# Altium project InkJetFin.PrjPCB
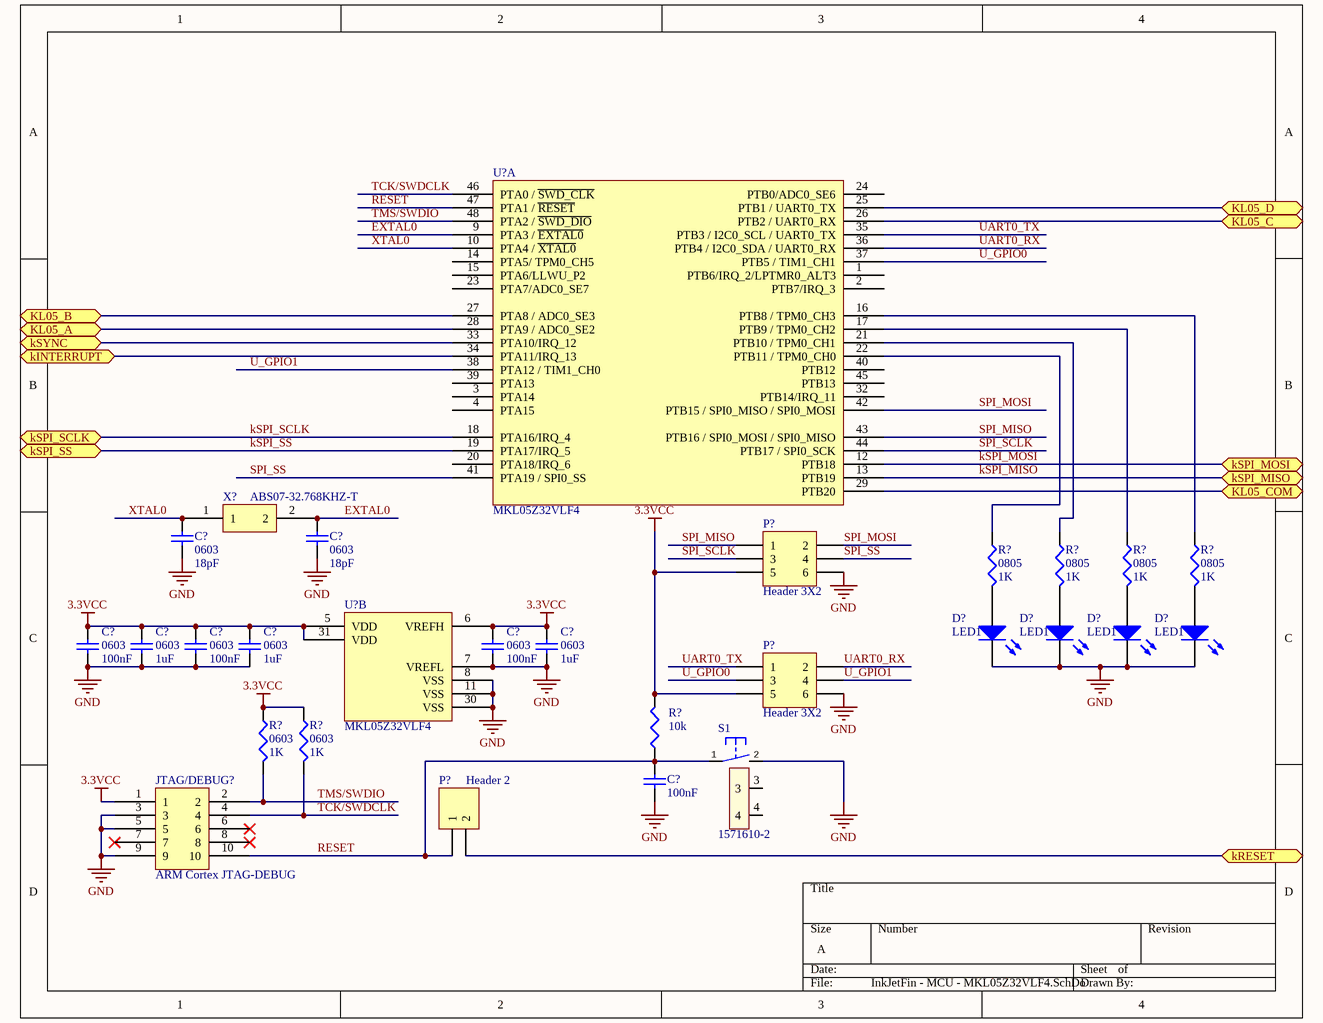
[diagram p0: InkJetFin - MCU - MKL05Z32VLF4.SchDoc]
5 sheets, 41 parts. Net scope: flat (ports and power ports of the same name join across sheets).
Sheets:
  InkJetFin - MCU - MKL05Z32VLF4.SchDoc
  InkJetFin - Power.SchDoc
  InkJetFin - InkJet Cartridge Interface.SchDoc
  InkJetFin - Kinen Port.SchDoc
  InkJetFin - System.SchDoc

## Sheet InkJetFin - MCU - MKL05Z32VLF4.SchDoc
size A

### Parts
(Parts that share a designator on the sheet are numbered #1, #2 ... from top to bottom, then left to right.)
C?#1  0603  value 18pF  [1608[0603]]
C?#2  0603  value 18pF  [1608[0603]]
C?#3  0603  value 100nF  [1608[0603]]
C?#4  0603  value 1uF  [1608[0603]]
C?#5  0603  value 100nF  [1608[0603]]
C?#6  0603  value 1uF  [1608[0603]]
C?#7  0603  value 100nF  [1608[0603]]
C?#8  0603  value 1uF  [1608[0603]]
C?#9  value 100nF  [1608[0603]]  (hidden comment: Cap Semi)
D?#1  LED1  [SM 0805 polarized]
D?#2  LED1  [SM 0805 polarized]
D?#3  LED1  [SM 0805 polarized]
D?#4  LED1  [SM 0805 polarized]
JTAG/DEBUG?  ARM Cortex JTAG-DEBUG  [FTSH-105-XX-X-DV]
P?#1  Header 3X2  [HDR2X3]
P?#2  Header 3X2  [HDR2X3]
P?#3  Header 2  [HDR1X2]
R?#1  0805  value 1K  [SM 0805 - gap trimmed]
R?#2  0805  value 1K  [SM 0805 - gap trimmed]
R?#3  0805  value 1K  [SM 0805 - gap trimmed]
R?#4  0805  value 1K  [SM 0805 - gap trimmed]
R?#5  0603  value 1K  [J1-0603]
R?#6  0603  value 1K  [J1-0603]
R?#7  value 10k  [J1-0603]  (hidden comment: Res3)
S1  1571610-2  [B3F-31XX]
U?#1  MKL05Z32VLF4  [MKL05Z32VLF4]  (part A of 2)
U?#2  MKL05Z32VLF4  [MKL05Z32VLF4]  (part B of 2)
X?  ABS07-32.768KHZ-T  [ABS07-32.768KHZ-T]

### Ports
kINTERRUPT, KL05_A, KL05_B, KL05_C, KL05_COM, KL05_D, kRESET, kSPI_MISO, kSPI_MOSI, kSPI_SCLK, kSPI_SS, kSYNC

### Nets
3.3VCC: C?#3.1 C?#4.1 C?#5.2 C?#6.2 C?#7.2 C?#8.2 JTAG/DEBUG?.1 P?#1.5 P?#2.5 R?#5.1 R?#6.1 R?#7.2 U?#2.5(VDD) U?#2.6(VREFH) U?#2.31(VDD)
GND: C?#1.2 C?#2.2 C?#3.2 C?#4.2 C?#5.1 C?#6.1 C?#7.1 C?#8.1 C?#9.1 D?#1.1(A) D?#2.1(A) D?#3.1(A) D?#4.1(A) JTAG/DEBUG?.3 JTAG/DEBUG?.5 JTAG/DEBUG?.9 P?#1.6 P?#2.6 S1.2(S) U?#2.7(VREFL) U?#2.8(VSS) U?#2.11(VSS) U?#2.30(VSS)
EXTAL0: C?#2.1 U?#1.9(PTA3_/_~{EXTAL0}) X?.2
kSPI_MISO: U?#1.13(PTB19) ; port kSPI_MISO
kSPI_MOSI: U?#1.12(PTB18) ; port kSPI_MOSI
kSPI_SCLK: U?#1.18(PTA16/IRQ_4) ; port kSPI_SCLK
kSPI_SS: U?#1.19(PTA17/IRQ_5) ; port kSPI_SS
RESET: C?#9.2 JTAG/DEBUG?.10 P?#3.1 R?#7.1 S1.1(P) U?#1.47(PTA1_/_~{RESET})
SPI_MISO: P?#1.1 U?#1.43(PTB16_/_SPI0_MOSI_/_SPI0_MISO)
SPI_MOSI: P?#1.2 U?#1.42(PTB15_/_SPI0_MISO_/_SPI0_MOSI)
SPI_SCLK: P?#1.3 U?#1.44(PTB17_/_SPI0_SCK)
SPI_SS: P?#1.4 U?#1.41(PTA19_/_SPI0_SS)
TCK/SWDCLK: JTAG/DEBUG?.4 R?#6.2 U?#1.46(PTA0_/_~{SWD_CLK})
TMS/SWDIO: JTAG/DEBUG?.2 R?#5.2 U?#1.48(PTA2_/_~{SWD_DIO})
U_GPIO0: P?#2.3 U?#1.37(PTB5_/_TIM1_CH1)
U_GPIO1: P?#2.4 U?#1.38(PTA12_/_TIM1_CH0)
UART0_RX: P?#2.2 U?#1.36(PTB4_/_I2C0_SDA_/_UART0_RX)
UART0_TX: P?#2.1 U?#1.35(PTB3_/_I2C0_SCL_/_UART0_TX)
XTAL0: C?#1.1 U?#1.10(PTA4_/_~{XTAL0}) X?.1
NetD?#1_2: D?#1.2(K) R?#1.2
NetD?#2_2: D?#2.2(K) R?#2.2
NetD?#3_2: D?#3.2(K) R?#3.2
NetD?#4_2: D?#4.2(K) R?#4.2
NetK?_11: P?#3.2 ; port kRESET
NetK?_13: U?#1.33(PTA10/IRQ_12) ; port kSYNC
NetK?_14: U?#1.34(PTA11/IRQ_13) ; port kINTERRUPT
NetR?#1_1: R?#1.1 U?#1.22(PTB11_/_TPM0_CH0)
NetR?#2_1: R?#2.1 U?#1.21(PTB10_/_TPM0_CH1)
NetR?#3_1: R?#3.1 U?#1.17(PTB9_/_TPM0_CH2)
NetR?#4_1: R?#4.1 U?#1.16(PTB8_/_TPM0_CH3)
NetU?#1_25: U?#1.25(PTB1_/_UART0_TX) ; port KL05_D
NetU?#1_26: U?#1.26(PTB2_/_UART0_RX) ; port KL05_C
NetU?#1_27: U?#1.27(PTA8_/_ADC0_SE3) ; port KL05_B
NetU?#1_28: U?#1.28(PTA9_/_ADC0_SE2) ; port KL05_A
NetU?#1_29: U?#1.29(PTB20) ; port KL05_COM

Not connected (* = marked no-connect by the designer): JTAG/DEBUG? 6* 7* 8*; S1 3 4; U?#1 1(PTB6/IRQ_2/LPTMR0_ALT3) 2(PTB7/IRQ_3) 3(PTA14) 4(PTA15) 14(PTA5/_TPM0_CH5) 15(PTA6/LLWU_P2) 20(PTA18/IRQ_6) 23(PTA7/ADC0_SE7) 24(PTB0/ADC0_SE6) 32(PTB14/IRQ_11) 39(PTA13) 40(PTB12) 45(PTB13)

### Library data of the parts
C?#1-C?#9 = Cap Semi: Capacitor (Semiconductor SIM Model); Published: 8-Jun-2000; LatestRevisionDate: 29-May-2009; LatestRevisionNote: IPC-7351 Footprint Added.; PackageReference: C1206; Publisher: Altium Limited; PackageDescription: Chip Capacitor
D?#1-D?#4 = LED1: Typical RED GaAs LED; Published: 8-Jun-2000; LatestRevisionDate: 08-Jul-2005; LatestRevisionNote: Mech Layer 1 removed.; PackageReference: LED-1; Publisher: Altium Limited; PackageDescription: LED; 2 Leads
JTAG/DEBUG? = ARM Cortex JTAG-DEBUG Header
P?#1 P?#2 = Header 3X2: Header, 3-Pin, Dual row; LatestRevisionDate: 17-Jul-2002; LatestRevisionNote: Re-released for DXP Platform.; Publisher: Altium Limited
P?#3 = Header 2: Header, 2-Pin; LatestRevisionDate: 17-Jul-2002; LatestRevisionNote: Re-released for DXP Platform.; Publisher: Altium Limited
R?#1-R?#7 = Res3: Resistor; Published: 8-Jun-2000; LatestRevisionDate: 29-May-2009; LatestRevisionNote: IPC-7351 Footprint Added.; PackageReference: J1-0603; Publisher: Altium Limited; PackageDescription: Chip Resistor
S1 = 1571610-2_1: SWTCH Momentary Washable; Manufacturer: Omron; Manufacturer: TE; LastRevisionNote: Import; ComponentLink1URL: http://www.te.com/commerce/DocumentDelivery/DDEController?Action=srchrtrv&DocNm=1571610&DocType=Customer+Drawing&DocLang=English; ComponentLink1Description: Datasheet for B3F-31XX; Published: 23-Apr-2014; Publisher: UltiMachine; LastRevisionDate: 23-Apr-2014; ManufacturerPartNumber: 1571610-2; Supplier 1: Mouser; Supplier Part Number 1: 506-1571610-2
U?#1 U?#2 = MKL05Z32VLF4: ARM Cortex M0+
X? = ABS07-32.768KHZ-T: ABS07-32.768KHZ-T RTC Crystal Oscillator

## Sheet InkJetFin - Power.SchDoc
size A

## Sheet InkJetFin - InkJet Cartridge Interface.SchDoc
size A
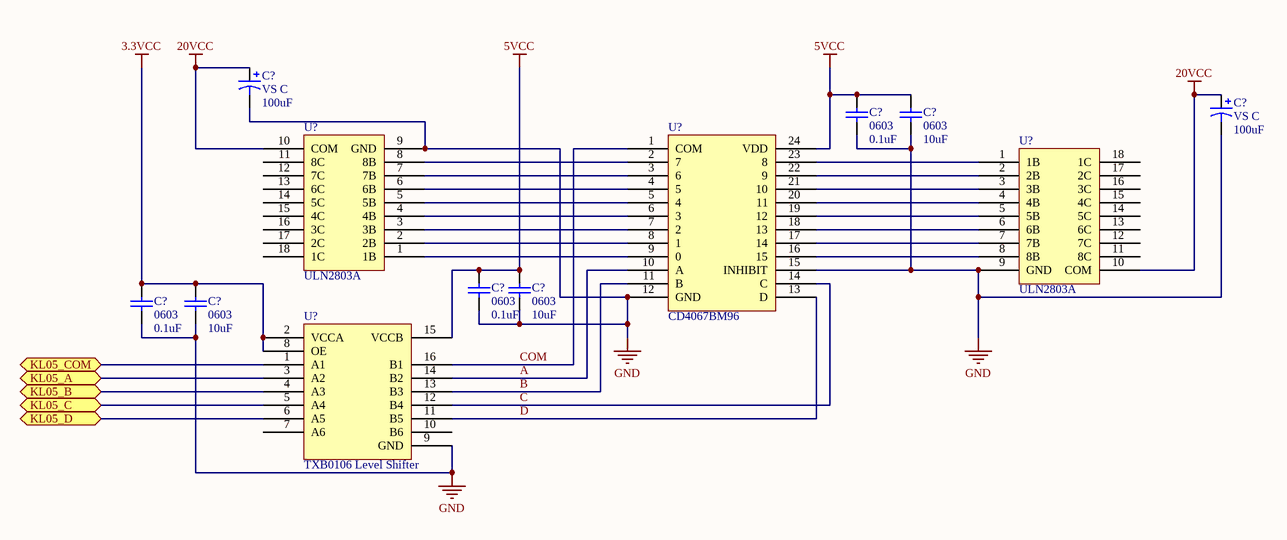
[diagram p1: InkJetFin - InkJet Cartridge Interface.SchDoc]

### Parts
(Parts that share a designator on the sheet are numbered #1, #2 ... from top to bottom, then left to right.)
C?#10  VS C  value 100uF  [Panasonic VS C]
C?#11  VS C  value 100uF  [Panasonic VS C]
C?#12  0603  value 0.1uF  [1608[0603]]
C?#13  0603  value 10uF  [1608[0603]]
C?#14  0603  value 0.1uF  [1608[0603]]
C?#15  0603  value 10uF  [1608[0603]]
C?#16  0603  value 0.1uF  [1608[0603]]
C?#17  0603  value 10uF  [1608[0603]]
U?#3  ULN2803A  [SOIC127P1030X265-18N]
U?#4  CD4067BM96  [TSOP65P640X120-24N]
U?#5  ULN2803A  [SOIC127P1030X265-18N]
U?#6  TXB0106 Level Shifter  [TSOP65P640X120-16N]

### Ports
KL05_A, KL05_B, KL05_C, KL05_COM, KL05_D

### Nets
3.3VCC: C?#16.2 C?#17.2 U?#6.2(VCCA) U?#6.8(OE)
5VCC: C?#12.2 C?#13.2 C?#14.2 C?#15.2 U?#4.24(VDD) U?#6.15(VCCB)
20VCC: C?#10.1 C?#11.1 U?#3.10(COM) U?#5.10(COM)
GND: C?#10.2 C?#11.2 C?#12.1 C?#13.1 C?#14.1 C?#15.1 C?#16.1 C?#17.1 U?#3.9(GND) U?#4.12(GND) U?#4.15(INHIBIT) U?#5.9(GND) U?#6.9(GND)
A: U?#4.10(A) U?#6.14(B2)
B: U?#4.11(B) U?#6.13(B3)
C: U?#4.14(C) U?#6.12(B4)
COM: U?#4.1(COM) U?#6.16(B1)
D: U?#4.13(D) U?#6.11(B5)
NetU?#1_25: U?#6.6(A5) ; port KL05_D
NetU?#1_26: U?#6.5(A4) ; port KL05_C
NetU?#1_27: U?#6.4(A3) ; port KL05_B
NetU?#1_28: U?#6.3(A2) ; port KL05_A
NetU?#1_29: U?#6.1(A1) ; port KL05_COM
NetU?#3_1: U?#3.1(1B) U?#4.9(0)
NetU?#3_2: U?#3.2(2B) U?#4.8(1)
NetU?#3_3: U?#3.3(3B) U?#4.7(2)
NetU?#3_4: U?#3.4(4B) U?#4.6(3)
NetU?#3_5: U?#3.5(5B) U?#4.5(4)
NetU?#3_6: U?#3.6(6B) U?#4.4(5)
NetU?#3_7: U?#3.7(7B) U?#4.3(6)
NetU?#3_8: U?#3.8(8B) U?#4.2(7)
NetU?#4_16: U?#4.16(15) U?#5.8(8B)
NetU?#4_17: U?#4.17(14) U?#5.7(7B)
NetU?#4_18: U?#4.18(13) U?#5.6(6B)
NetU?#4_19: U?#4.19(12) U?#5.5(5B)
NetU?#4_20: U?#4.20(11) U?#5.4(4B)
NetU?#4_21: U?#4.21(10) U?#5.3(3B)
NetU?#4_22: U?#4.22(9) U?#5.2(2B)
NetU?#4_23: U?#4.23(8) U?#5.1(1B)

Not connected (* = marked no-connect by the designer): U?#3 11(8C) 12(7C) 13(6C) 14(5C) 15(4C) 16(3C) 17(2C) 18(1C); U?#5 11(8C) 12(7C) 13(6C) 14(5C) 15(4C) 16(3C) 17(2C) 18(1C); U?#6 7(A6) 10(B6)

### Library data of the parts
C?#10 C?#11 = Cap Pol1: Polarized Capacitor (Radial); Published: 8-Jun-2000; LatestRevisionDate: 17-Jul-2002; LatestRevisionNote: Re-released for DXP Platform.; PackageReference: RB7.6-15; Publisher: Altium Limited; PackageDescription: Polarized Capacitor (Radial); 2 Leads
C?#12-C?#17 = Cap Semi: Capacitor (Semiconductor SIM Model); Published: 8-Jun-2000; LatestRevisionDate: 29-May-2009; LatestRevisionNote: IPC-7351 Footprint Added.; PackageReference: C1206; Publisher: Altium Limited; PackageDescription: Chip Capacitor
U?#3 U?#5 = Ti ULN2803A
U?#4 = Ti CD4067BM96
U?#6 = TXB0106: TXB0106 - Bidriectional Opendrain/pushpull level shift

## Sheet InkJetFin - Kinen Port.SchDoc
size A
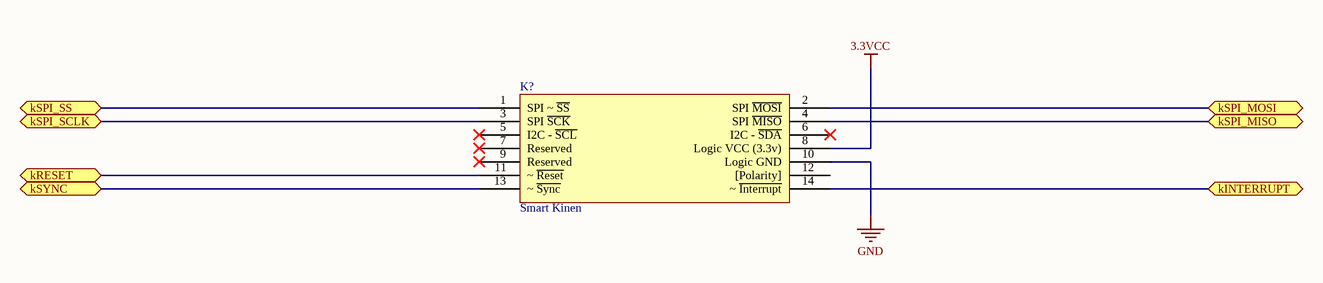
[diagram p2: InkJetFin - Kinen Port.SchDoc]

### Parts
K?  Smart Kinen  [Kinen Port - Device]

### Ports
kINTERRUPT, kRESET, kSPI_MISO, kSPI_MOSI, kSPI_SCLK, kSPI_SS, kSYNC

### Nets
3.3VCC: K?.8(Logic_VCC_(3.3v))
GND: K?.10(Logic_GND)
kSPI_MISO: K?.4(SPI_~{MISO}) ; port kSPI_MISO
kSPI_MOSI: K?.2(SPI_~{MOSI}) ; port kSPI_MOSI
kSPI_SCLK: K?.3(SPI_~{SCK}) ; port kSPI_SCLK
kSPI_SS: K?.1(SPI_~_~{SS}) ; port kSPI_SS
NetK?_11: K?.11(~_~{Reset}) ; port kRESET
NetK?_13: K?.13(~_~{Sync}) ; port kSYNC
NetK?_14: K?.14(~_~{Interrupt}) ; port kINTERRUPT

Not connected (* = marked no-connect by the designer): K? 5(I2C_-_~{SCL})* 6(I2C_-_~{SDA})* 7(Reserved)* 9(Reserved)* 12([Polarity])

### Library data of the parts
K? = Kinen Device NEW Smart

## Sheet InkJetFin - System.SchDoc
size A

## Nets that join several sheets
3.3VCC: InkJetFin - MCU - MKL05Z32VLF4 (15 pins), InkJetFin - InkJet Cartridge Interface (C?#16.2 C?#17.2 U?#6.2 U?#6.8), InkJetFin - Kinen Port (K?.8)
GND: InkJetFin - MCU - MKL05Z32VLF4 (23 pins), InkJetFin - InkJet Cartridge Interface (13 pins), InkJetFin - Kinen Port (K?.10)
kSPI_MISO: InkJetFin - MCU - MKL05Z32VLF4 (U?#1.13), InkJetFin - Kinen Port (K?.4)
kSPI_MOSI: InkJetFin - MCU - MKL05Z32VLF4 (U?#1.12), InkJetFin - Kinen Port (K?.2)
kSPI_SCLK: InkJetFin - MCU - MKL05Z32VLF4 (U?#1.18), InkJetFin - Kinen Port (K?.3)
kSPI_SS: InkJetFin - MCU - MKL05Z32VLF4 (U?#1.19), InkJetFin - Kinen Port (K?.1)
NetK?_11: InkJetFin - MCU - MKL05Z32VLF4 (P?#3.2), InkJetFin - Kinen Port (K?.11)
NetK?_13: InkJetFin - MCU - MKL05Z32VLF4 (U?#1.33), InkJetFin - Kinen Port (K?.13)
NetK?_14: InkJetFin - MCU - MKL05Z32VLF4 (U?#1.34), InkJetFin - Kinen Port (K?.14)
NetU?#1_25: InkJetFin - MCU - MKL05Z32VLF4 (U?#1.25), InkJetFin - InkJet Cartridge Interface (U?#6.6)
NetU?#1_26: InkJetFin - MCU - MKL05Z32VLF4 (U?#1.26), InkJetFin - InkJet Cartridge Interface (U?#6.5)
NetU?#1_27: InkJetFin - MCU - MKL05Z32VLF4 (U?#1.27), InkJetFin - InkJet Cartridge Interface (U?#6.4)
NetU?#1_28: InkJetFin - MCU - MKL05Z32VLF4 (U?#1.28), InkJetFin - InkJet Cartridge Interface (U?#6.3)
NetU?#1_29: InkJetFin - MCU - MKL05Z32VLF4 (U?#1.29), InkJetFin - InkJet Cartridge Interface (U?#6.1)